# Altium project DC_motor_driver.PrjPcb
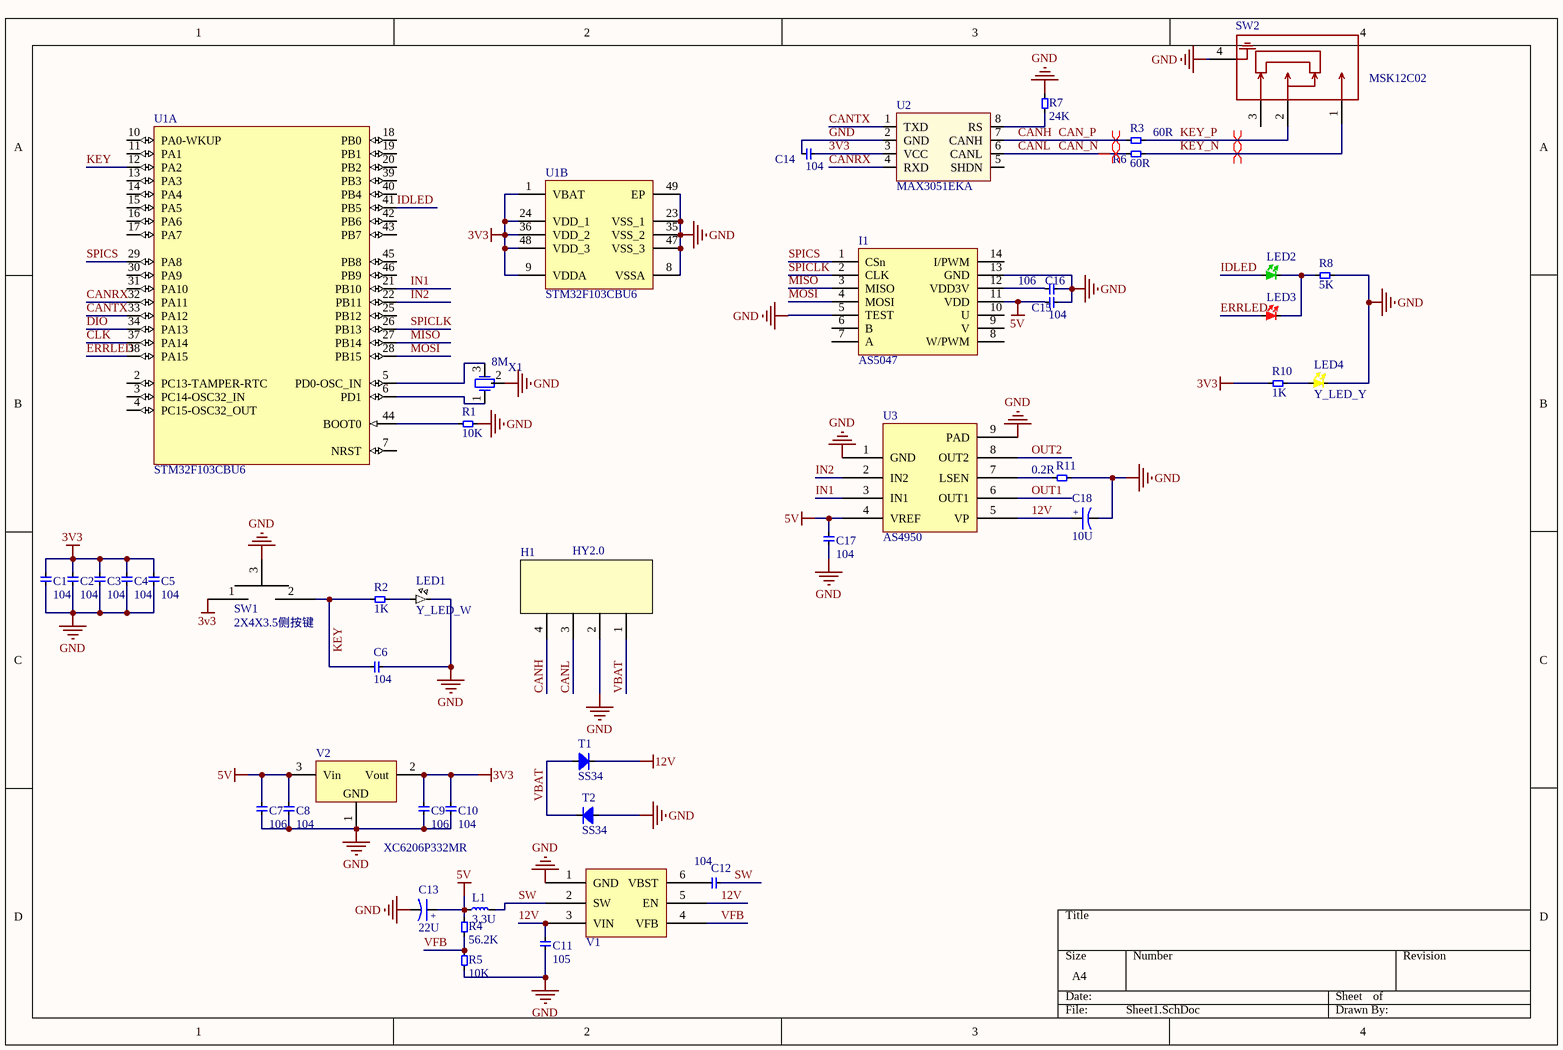
[diagram p0: Sheet1.SchDoc]
1 sheet, 45 parts. Net scope: global (net labels, ports and power ports of the same name join across sheets).
Board file: PCB1.PcbDoc

## Sheet Sheet1.SchDoc
size A4; SheetNumber: 1; SheetTotal: 1

### Parts
C1  104  [C_0603]
C2  104  [C_0603]
C3  104  [C_0603]
C4  104  [C_0603]
C5  104  [C_0603]
C6  104  [C_0603]
C7  106  [C_0603]
C8  104  [C_0603]
C9  106  [C_0603]
C10  104  [C_0603]
C11  105  [C_0805]
C12  104  [C_0603]
C13  22U  [SMD-EC-F4]
C14  104  [C_0603]
C15  104  [C_0603]
C16  106  [C_0603]
C17  104  [C_0603]
C18  10U  [SMD-EC-F4]
H1  HY2.0  [HY2.0_4P_插弯]
I1  AS5047  [TSSOP14]
L1  3.3U  [NR4030]
LED1  Y_LED_W  [Y_LED_0603_W]
LED2  Y_LED_G  [Y_LED_0603_G]  (value not drawn)
LED3  Y_LED_R  [Y_LED_0603_R]  (value not drawn)
LED4  Y_LED_Y  [Y_LED_0603_Y]
R1  10K  [R_0603]
R2  1K  [R_0603]
R3  60R  [R_0603]
R4  56.2K  [R_0603]
R5  10K  [R_0603]
R6  60R  [R_0603]
R7  24K  [R_0603]
R8  5K  [R_0603]
R10  1K  [R_0603]
R11  0.2R  [R_0603]
SW1  2X4X3.5侧按键  [2X4X3.5贴片侧按开关]
SW2  MSK12C02  [MSK12C02]
T1  SS34  [T_DIODE_SOD-123]
T2  SS34  [T_DIODE_SOD-123]
U1  STM32F103CBU6  [VFQFPN48_N]  (parts A,B of 2)
U2  MAX3051EKA  [SOT23-8]
U3  AS4950  [SOP8-EP]
V1  TPS56320  [SOT23-6]  (value not drawn)
V2  XC6206P332MR  [SOT23-3N]
X1  8M  [XTAL-3.2*1.3MM]

### Nets
3V3: C1.2 C2.2 C3.2 C4.2 C5.2 C9.2 C10.2 C14.2 R10.1 SW1.1 U1.1(VBAT) U1.9(VDDA) U1.24(VDD_1) U1.36(VDD_2) U1.48(VDD_3) U2.3(VCC) V2.2(Vout)
5V: C7.2 C8.2 C13.1 C15.1 C17.2 I1.11(VDD) L1.1 R4.1 U3.4(VREF) V2.3(Vin)
12V: C11.2 C18.1 T1.2(K) U3.5(VP) V1.3(VIN) V1.5(EN)
GND: C1.1 C2.1 C3.1 C4.1 C5.1 C6.2 C7.1 C8.1 C9.1 C10.1 C11.1 C13.2 C14.1 C15.2 C16.2 C17.1 C18.2 H1.2 I1.5(TEST) I1.13(GND) LED1.2 LED4.2 R1.2 R5.2 R7.2 R8.2 R11.2 SW1.3 SW2.4 T2.1(A) U1.8(VSSA) U1.23(VSS_1) U1.35(VSS_2) U1.47(VSS_3) U1.49(EP) U2.2(GND) U3.1(GND) U3.9(PAD) V1.1(GND) V2.1(GND) X1.2
CAN_N: H1.3 R6.1 U2.6(CANL)  [also labelled CANL]
CAN_P: H1.4 R3.1 U2.7(CANH)  [also labelled CANH]
CANRX: U1.32(PA11) U2.4(RXD)
CANTX: U1.33(PA12) U2.1(TXD)
CLK: U1.37(PA14)
DIO: U1.34(PA13)
ERRLED: LED3.1 U1.38(PA15)
IDLED: LED2.1 U1.41(PB5)
IN1: U1.21(PB10) U3.3(IN1)
IN2: U1.22(PB11) U3.2(IN2)
KEY: C6.1 R2.1 SW1.2 U1.12(PA2)
KEY_N: R6.2 SW2.1
KEY_P: R3.2 SW2.2
MISO: I1.3(MISO) U1.27(PB14)
MOSI: I1.4(MOSI) U1.28(PB15)
OUT1: U3.6(OUT1)
OUT2: U3.8(OUT2)
SPICLK: I1.2(CLK) U1.26(PB13)
SPICS: I1.1(CSn) U1.29(PA8)
SW: C12.2 L1.2 V1.2(SW)
VBAT: H1.1 T1.1(A) T2.2(K)
VFB: R4.2 R5.1 V1.4(VFB)
NetC12_1: C12.1 V1.6(VBST)
NetC16_1: C16.1 I1.12(VDD3V)
NetLED1_1: LED1.1 R2.2
NetLED2_2: LED2.2 LED3.2 R8.1
NetLED4_1: LED4.1 R10.2
NetR1_1: R1.1 U1.44(BOOT0)
NetR7_1: R7.1 U2.8(RS)
NetR11_1: R11.1 U3.7(LSEN)
NetU1_5: U1.5(PD0-OSC_IN) X1.3
NetU1_6: U1.6(PD1) X1.1(OSC1)

Not connected (* = marked no-connect by the designer): I1 6(B) 7(A) 8(W/PWM) 9(V) 10(U) 14(I/PWM); SW2 3; U1 2(PC13-TAMPER-RTC) 3(PC14-OSC32_IN) 4(PC15-OSC32_OUT) 7(NRST) 10(PA0-WKUP) 11(PA1) 13(PA3) 14(PA4) 15(PA5) 16(PA6) 17(PA7) 18(PB0) 19(PB1) 20(PB2) 25(PB12) 30(PA9) 31(PA10) 39(PB3) 40(PB4) 42(PB6) 43(PB7) 45(PB8) 46(PB9); U2 5(SHDN)

### Layout directives
differential pair: CAN_N, CAN_P, KEY_N, KEY_P

### Notes on the sheet
- (in symbol C_贴片电解) +

### Library data of the parts
C1-C12 C14-C17 = C_无极贴片: 无极性贴片电容
C13 C18 = C_贴片电解: 贴片电解电容
H1 = HY2.0_4P
I1 = AS5047: 磁编码器芯片
L1 = L_贴片功率: 贴片屏蔽式功率电感
LED1 = Y_LED_W: 白色LED
LED2 = Y_LED_G: 绿色LED
LED3 = Y_LED_R: 红色LED
LED4 = Y_LED_Y: 黄色LED
R1-R8 R10 R11 = R_贴片: 贴片电阻
SW2 = MSK12C02: 单刀双掷开关，卧贴，额定电流：50mA，额定电压：12V
T1 T2 = T_Sch_Diode_SSXX: SSXX系列肖特基二极管; LatestRevisionDate: 17-Jul-2002; LatestRevisionNote: Re-released for DXP Platform.; Publisher: Altium Limited
U1 = STM32F103CBU6: STM32 ARM-based 32-bit MCU Performance Line with 128 kB Flash, 20 kB Internal RAM, -40 to +85癈 Temperature, 48-Pin VFQFPN, Tray; DatasheetVersion: rev13.0, Apr-2011; PackageVersion: 2011; PackageReference: VFQFPN48; PackageDescription: 48-Pin Quad Flat No-Lead, 7 x 7 x 0.9 mm Body, 0.5 mm Pitch, Exposed Pad; ComponentLink1Description: Manufacturer URL; ComponentLink1URL: http://www.st.com/; ComponentLink2Description: STM32F103 Datasheet; ComponentLink2URL: http://www.st.com/internet/com/TECHNICAL_RESOURCES/TECHNICAL_LITERATURE/DATASHEET/CD00161566.pdf; ComponentLink3Description: STM32 Family Web Page; ComponentLink3URL: www.st.com/stm32
U2 = MAX3051EKA: CAN-1Mbps
U3 = AS4950: 直流电机驱动，3A
V1 = TPS56320: 小封装3A开关电源
V2 = XC6206P332MR: 低压差线性稳压芯片; 版权归属: 源创客; BOM名称: 低压差线性稳压芯片; 学习资源: www.ooocke.com
X1 = XTAL-3213-3P: 8~20M-3.2*1.3mm-3P